# Altium schematic sheet Channel_A.SchDoc
size OrCAD E; SheetNumber: 5; SheetTotal: 6
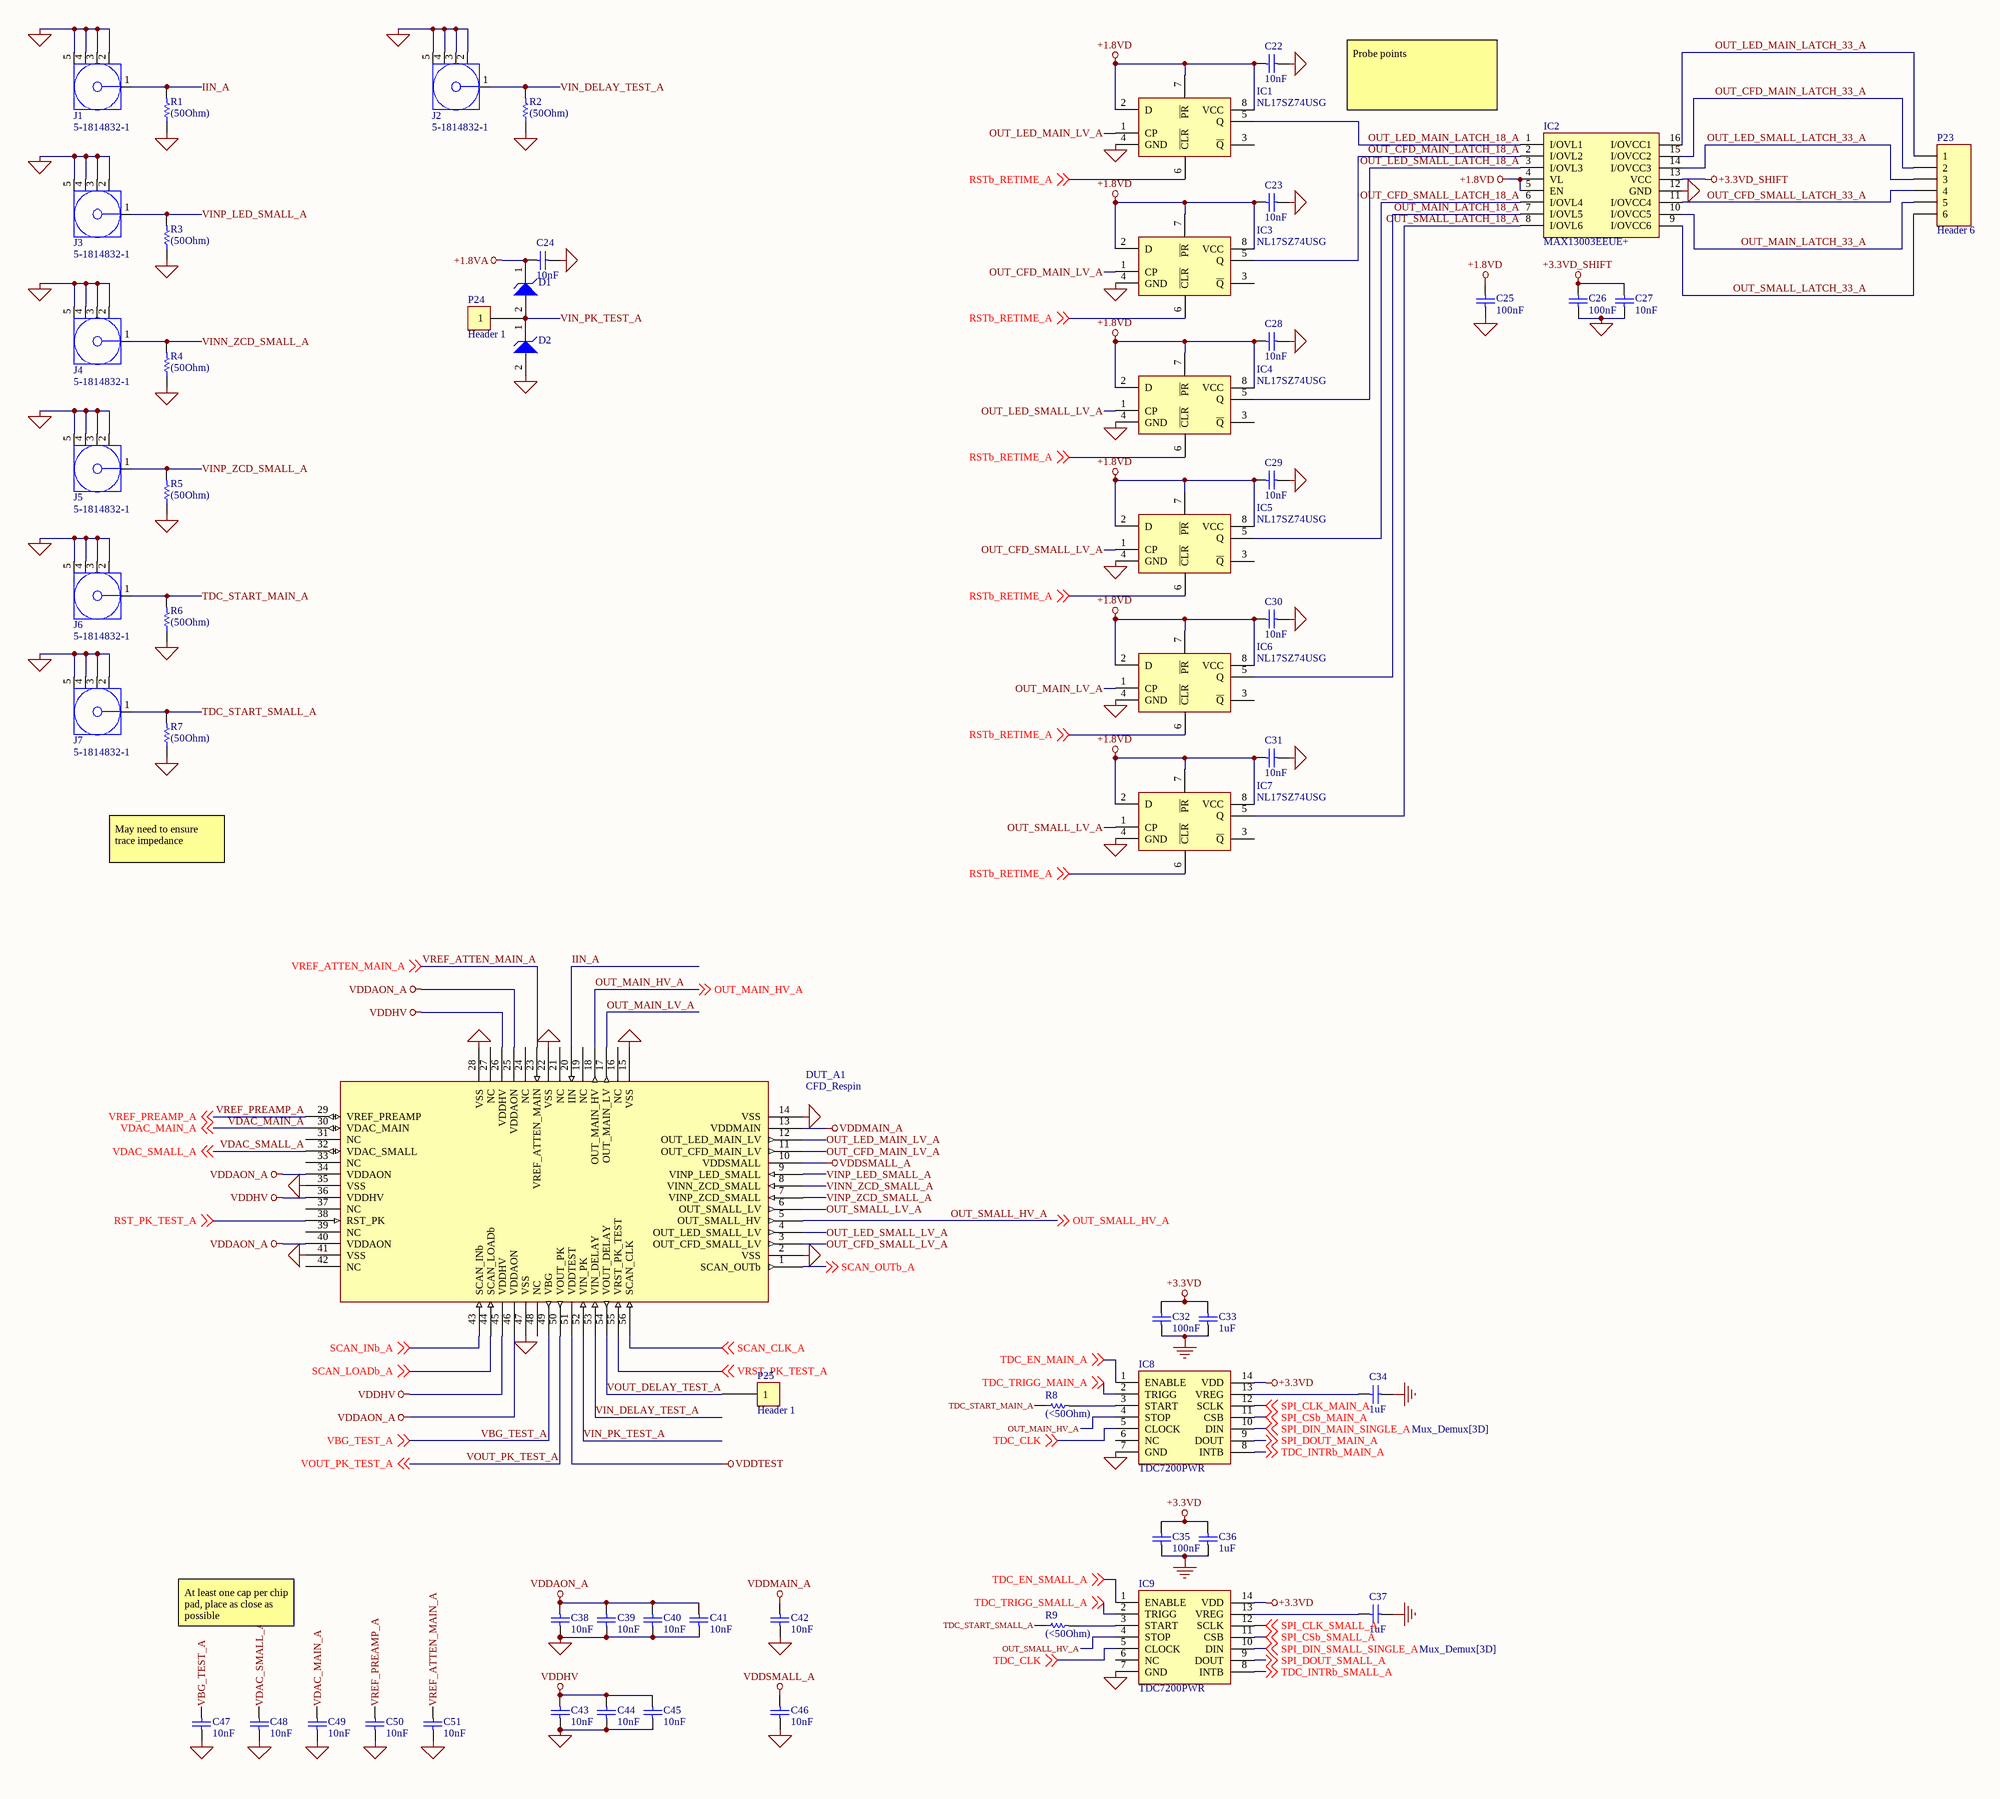
[diagram p0: Channel_A.SchDoc]

## Parts
C22  10nF  [CAPC1608X90X35ML10T15]
C23  10nF  [CAPC1608X90X35ML10T15]
C24  10nF  [CAPC1608X90X35ML10T15]
C25  100nF  [CAPC1608X90X35ML10T15]
C26  100nF  [CAPC1608X90X35ML10T15]
C27  10nF  [CAPC1608X90X35ML10T15]
C28  10nF  [CAPC1608X90X35ML10T15]
C29  10nF  [CAPC1608X90X35ML10T15]
C30  10nF  [CAPC1608X90X35ML10T15]
C31  10nF  [CAPC1608X90X35ML10T15]
C32  100nF  [CAPC1608X90X35ML10T15]
C33  1uF  [CAPC1608X90X35ML10T15]
C34  1uF  [CAPC1608X90X35ML10T15]
C35  100nF  [CAPC1608X90X35ML10T15]
C36  1uF  [CAPC1608X90X35ML10T15]
C37  1uF  [CAPC1608X90X35ML10T15]
C38  10nF  [CAPC1608X90X35ML10T15]
C39  10nF  [CAPC1608X90X35ML10T15]
C40  10nF  [CAPC1608X90X35ML10T15]
C41  10nF  [CAPC1608X90X35ML10T15]
C42  10nF  [CAPC1608X90X35ML10T15]
C43  10nF  [CAPC1608X90X35ML10T15]
C44  10nF  [CAPC1608X90X35ML10T15]
C45  10nF  [CAPC1608X90X35ML10T15]
C46  10nF  [CAPC1608X90X35ML10T15]
C47  10nF  [CAPC1608X90X35ML10T15]
C48  10nF  [CAPC1608X90X35ML10T15]
C49  10nF  [CAPC1608X90X35ML10T15]
C50  10nF  [CAPC1608X90X35ML10T15]
C51  10nF  [CAPC1608X90X35ML10T15]
D1  (no value)  [ONSC-SOD-123-2-425-04_V]
D2  (no value)  [ONSC-SOD-123-2-425-04_V]
DUT_A1  CFD_Respin  [QFN50P800X800X80_HS-57N_WIDEVIAS]
IC1  NL17SZ74USG  [SOP50P310X90-8N]
IC2  MAX13003EEUE+  [SOP65P640X110-16N]
IC3  NL17SZ74USG  [SOP50P310X90-8N]
IC4  NL17SZ74USG  [SOP50P310X90-8N]
IC5  NL17SZ74USG  [SOP50P310X90-8N]
IC6  NL17SZ74USG  [SOP50P310X90-8N]
IC7  NL17SZ74USG  [SOP50P310X90-8N]
IC8  TDC7200PWR  [SOP65P640X120-14N]
IC9  TDC7200PWR  [SOP65P640X120-14N]
J1  5-1814832-1  [TECO-5-1814832-1_V]
J2  5-1814832-1  [TECO-5-1814832-1_V]
J3  5-1814832-1  [TECO-5-1814832-1_V]
J4  5-1814832-1  [TECO-5-1814832-1_V]
J5  5-1814832-1  [TECO-5-1814832-1_V]
J6  5-1814832-1  [TECO-5-1814832-1_V]
J7  5-1814832-1  [TECO-5-1814832-1_V]
P23  Header 6  [HDR1X6]
P24  Header 1  [Header1]
P25  Header 1  [Header1]
R1  (50Ohm)  [RESC1609X50X30NL8T20]
R2  (50Ohm)  [RESC1609X50X30NL8T20]
R3  (50Ohm)  [RESC1609X50X30NL8T20]
R4  (50Ohm)  [RESC1609X50X30NL8T20]
R5  (50Ohm)  [RESC1609X50X30NL8T20]
R6  (50Ohm)  [RESC1609X50X30NL8T20]
R7  (50Ohm)  [RESC1609X50X30NL8T20]
R8  (<50Ohm)  [RESC1609X50X30NL8T20]
R9  (<50Ohm)  [RESC1609X50X30NL8T20]

## Nets
+1.8VA: C24.2 D1.1(K)
+1.8VD: C22.2 C23.2 C25.2 C28.2 C29.2 C30.2 C31.2 IC1.2(D) IC1.7(~{PR}) IC1.8(VCC) IC2.4(VL) IC2.5(EN) IC3.2(D) IC3.7(~{PR}) IC3.8(VCC) IC4.2(D) IC4.7(~{PR}) IC4.8(VCC) IC5.2(D) IC5.7(~{PR}) IC5.8(VCC) IC6.2(D) IC6.7(~{PR}) IC6.8(VCC) IC7.2(D) IC7.7(~{PR}) IC7.8(VCC)
+3.3VD: C32.1 C33.1 C35.1 C36.1 IC8.14(VDD) IC9.14(VDD)
+3.3VD_SHIFT: C26.2 C27.2 IC2.13(VCC)
GND: C22.1 C23.1 C24.1 C25.1 C26.1 C27.1 C28.1 C29.1 C30.1 C31.1 C32.2 C33.2 C34.2 C35.2 C36.2 C37.2 C38.1 C39.1 C40.1 C41.1 C42.1 C43.1 C44.1 C45.1 C46.1 C47.1 C48.1 C49.1 C50.1 C51.1 D2.2(A) DUT_A1.2(VSS) DUT_A1.14(VSS) DUT_A1.15(VSS) DUT_A1.22(VSS) DUT_A1.28(VSS) DUT_A1.35(VSS) DUT_A1.41(VSS) DUT_A1.47(VSS) IC1.4(GND) IC2.12(GND) IC3.4(GND) IC4.4(GND) IC5.4(GND) IC6.4(GND) IC7.4(GND) IC8.7(GND) IC9.7(GND) J1.2 J1.3 J1.4 J1.5 J2.2 J2.3 J2.4 J2.5 J3.2 J3.3 J3.4 J3.5 J4.2 J4.3 J4.4 J4.5 J5.2 J5.3 J5.4 J5.5 J6.2 J6.3 J6.4 J6.5 J7.2 J7.3 J7.4 J7.5 R1.1 R2.1 R3.1 R4.1 R5.1 R6.1 R7.1
VDDAON_A: C38.2 C39.2 C40.2 C41.2 DUT_A1.25(VDDAON) DUT_A1.34(VDDAON) DUT_A1.40(VDDAON) DUT_A1.46(VDDAON)
VDDHV: C43.2 C44.2 C45.2 DUT_A1.26(VDDHV) DUT_A1.36(VDDHV) DUT_A1.45(VDDHV)
VDDMAIN_A: C42.2 DUT_A1.13(VDDMAIN)
VDDSMALL_A: C46.2 DUT_A1.10(VDDSMALL)
VDDTEST: DUT_A1.51(VDDTEST)
IIN_A: DUT_A1.20(IIN) J1.1 R1.2
OUT_CFD_MAIN_LATCH_18_A: IC2.2(I/OVL2) IC3.5(Q)
OUT_CFD_MAIN_LATCH_33_A: IC2.15(I/OVCC2) P23.2
OUT_CFD_MAIN_LV_A: DUT_A1.11(OUT_CFD_MAIN_LV) IC3.1(CP)
OUT_CFD_SMALL_LATCH_18_A: IC2.6(I/OVL4) IC5.5(Q)
OUT_CFD_SMALL_LATCH_33_A: IC2.11(I/OVCC4) P23.4
OUT_CFD_SMALL_LV_A: DUT_A1.3(OUT_CFD_SMALL_LV) IC5.1(CP)
OUT_LED_MAIN_LATCH_18_A: IC1.5(Q) IC2.1(I/OVL1)
OUT_LED_MAIN_LATCH_33_A: IC2.16(I/OVCC1) P23.1
OUT_LED_MAIN_LV_A: DUT_A1.12(OUT_LED_MAIN_LV) IC1.1(CP)
OUT_LED_SMALL_LATCH_18_A: IC2.3(I/OVL3) IC4.5(Q)
OUT_LED_SMALL_LATCH_33_A: IC2.14(I/OVCC3) P23.3
OUT_LED_SMALL_LV_A: DUT_A1.4(OUT_LED_SMALL_LV) IC4.1(CP)
OUT_MAIN_HV_A: DUT_A1.18(OUT_MAIN_HV) IC8.4(STOP) ; off-sheet OUT_MAIN_HV_A
OUT_MAIN_LATCH_18_A: IC2.7(I/OVL5) IC6.5(Q)
OUT_MAIN_LATCH_33_A: IC2.10(I/OVCC5) P23.5
OUT_MAIN_LV_A: DUT_A1.17(OUT_MAIN_LV) IC6.1(CP)
OUT_SMALL_HV_A: DUT_A1.5(OUT_SMALL_HV) IC9.4(STOP) ; off-sheet OUT_SMALL_HV_A
OUT_SMALL_LATCH_18_A: IC2.8(I/OVL6) IC7.5(Q)
OUT_SMALL_LATCH_33_A: IC2.9(I/OVCC6) P23.6
OUT_SMALL_LV_A: DUT_A1.6(OUT_SMALL_LV) IC7.1(CP)
RST_PK_TEST_A: DUT_A1.38(RST_PK) ; off-sheet RST_PK_TEST_A
RSTb_RETIME_A: IC1.6(~{CLR}) IC3.6(~{CLR}) IC4.6(~{CLR}) IC5.6(~{CLR}) IC6.6(~{CLR}) IC7.6(~{CLR}) ; off-sheet RSTb_RETIME_A
SCAN_CLK_A: DUT_A1.56(SCAN_CLK) ; off-sheet SCAN_CLK_A
SCAN_INb_A: DUT_A1.43(SCAN_INb) ; off-sheet SCAN_INb_A
SCAN_LOADb_A: DUT_A1.44(SCAN_LOADb) ; off-sheet SCAN_LOADb_A
SCAN_OUTb_A: DUT_A1.1(SCAN_OUTb) ; off-sheet SCAN_OUTb_A
SPI_CLK_MAIN_A: IC8.12(SCLK) ; off-sheet SPI_CLK_MAIN_A
SPI_CLK_SMALL_A: IC9.12(SCLK) ; off-sheet SPI_CLK_SMALL_A
SPI_CSb_MAIN_A: IC8.11(CSB) ; off-sheet SPI_CSb_MAIN_A
SPI_CSb_SMALL_A: IC9.11(CSB) ; off-sheet SPI_CSb_SMALL_A
SPI_DIN_MAIN_SINGLE_A: IC8.10(DIN) ; off-sheet SPI_DIN_MAIN_SINGLE_A
SPI_DIN_SMALL_SINGLE_A: IC9.10(DIN) ; off-sheet SPI_DIN_SMALL_SINGLE_A
SPI_DOUT_MAIN_A: IC8.9(DOUT) ; off-sheet SPI_DOUT_MAIN_A
SPI_DOUT_SMALL_A: IC9.9(DOUT) ; off-sheet SPI_DOUT_SMALL_A
TDC_CLK: IC8.5(CLOCK) IC9.5(CLOCK) ; off-sheet TDC_CLK
TDC_EN_MAIN_A: IC8.1(ENABLE) ; off-sheet TDC_EN_MAIN_A
TDC_EN_SMALL_A: IC9.1(ENABLE) ; off-sheet TDC_EN_SMALL_A
TDC_INTRb_MAIN_A: IC8.8(INTB) ; off-sheet TDC_INTRb_MAIN_A
TDC_INTRb_SMALL_A: IC9.8(INTB) ; off-sheet TDC_INTRb_SMALL_A
TDC_START_MAIN_A: J6.1 R6.2 R8.1
TDC_START_SMALL_A: J7.1 R7.2 R9.1
TDC_TRIGG_MAIN_A: IC8.2(TRIGG) ; off-sheet TDC_TRIGG_MAIN_A
TDC_TRIGG_SMALL_A: IC9.2(TRIGG) ; off-sheet TDC_TRIGG_SMALL_A
VBG_TEST_A: C47.2 DUT_A1.49(VBG) ; off-sheet VBG_TEST_A
VDAC_MAIN_A: C49.2 DUT_A1.30(VDAC_MAIN) ; off-sheet VDAC_MAIN_A
VDAC_SMALL_A: C48.2 DUT_A1.32(VDAC_SMALL) ; off-sheet VDAC_SMALL_A
VIN_DELAY_TEST_A: DUT_A1.53(VIN_DELAY) J2.1 R2.2
VIN_PK_TEST_A: D1.2(A) D2.1(K) DUT_A1.52(VIN_PK) P24.1
VINN_ZCD_SMALL_A: DUT_A1.8(VINN_ZCD_SMALL) J4.1 R4.2
VINP_LED_SMALL_A: DUT_A1.9(VINP_LED_SMALL) J3.1 R3.2
VINP_ZCD_SMALL_A: DUT_A1.7(VINP_ZCD_SMALL) J5.1 R5.2
VOUT_DELAY_TEST_A: DUT_A1.54(VOUT_DELAY) P25.1
VOUT_PK_TEST_A: DUT_A1.50(VOUT_PK) ; off-sheet VOUT_PK_TEST_A
VREF_ATTEN_MAIN_A: C51.2 DUT_A1.23(VREF_ATTEN_MAIN) ; off-sheet VREF_ATTEN_MAIN_A
VREF_PREAMP_A: C50.2 DUT_A1.29(VREF_PREAMP) ; off-sheet VREF_PREAMP_A
VRST_PK_TEST_A: DUT_A1.55(VRST_PK_TEST) ; off-sheet VRST_PK_TEST_A
NetC34_1: C34.1 IC8.13(VREG)
NetC37_1: C37.1 IC9.13(VREG)
NetIC8_3: IC8.3(START) R8.2
NetIC9_3: IC9.3(START) R9.2

Not connected (* = marked no-connect by the designer): DUT_A1 16(NC) 19(NC) 21(NC) 24(NC) 27(NC) 31(NC) 33(NC) 37(NC) 39(NC) 42(NC) 48(NC); IC1 3(~{Q}); IC3 3(~{Q}); IC4 3(~{Q}); IC5 3(~{Q}); IC6 3(~{Q}); IC7 3(~{Q}); IC8 6(NC); IC9 6(NC)

## Notes on the sheet
- Probe points
- May need to ensure trace impedance
- At least one cap per chip pad, place as close as possible

## Library data of the parts
C22-C51 = CMP-2000-04945-1: 0603; Manufacturer: Murata; Capacitance: 22pF; Tolerance (%): ±5%; Rated Voltage: 50V; Dielectric: C0G; Manufacturer URL: http://www.murata.com/; Datasheet Version: Jul-06; Package Reference: 603; Case Size/Dimension: 0603; Package Description: 2-Pin Surface Mount Device, Body 1.6 x 0.8 mm; Datasheet URL: https://datasheet.ciiva.com/11786/0900766b807a1cab-11786398.pdf
D1 D2 = CMP-1060-00509-1: Zener Voltage Regulator, 2-Pin SOD-123, Pb-Free, Tape and Reel; Manufacturer: On Semiconductor; PartNumber: MMSZ4679T1G; P Max (W): 0.5; VZ Typ (V): 2; Packing: Tape and Reel; ComponentLink1Description: Manufacturer URL; DatasheetVersion: Rev. 9; PackageReference: SOD-123-2-425-04; ComponentLink3URL: http://www.onsemi.com/pub_link/Collateral/425-04.PDF; PackageDescription: 2-Pin SOD, Body 1.6 x 2.69 mm; ComponentLink3Description: Package Specification; ComponentLink2Description: Datasheet; ComponentLink1URL: http://www.onsemi.com/; RoHS: Pb-Free; PackageVersion: Rev. G, 10/2009; ComponentLink2URL: http://www.onsemi.com/pub_link/Collateral/MMSZ4678T1-D.PDF; Mounting Technology: Surface Mount
IC1 IC3-IC7 = NL17SZ74USG: Flip Flops 1.65-5.5V CMOS Single D-Type; Manufacturer_Name: ON Semiconductor; Datasheet Link: http://www.onsemi.com/pub/Collateral/NL17SZ74-D.PDF; Height: 0.9mm; Manufacturer_Part_Number: NL17SZ74USG
IC2 = MAX13003EEUE+: Integrated Circuit; Manufacturer_Name: Maxim Integrated; Datasheet Link: https://pdfserv.maximintegrated.com/en/ds/MAX13000E-MAX13005E.pdf; Height: 1.1mm; Manufacturer_Part_Number: MAX13003EEUE+
IC8 IC9 = TDC7200PWR: Integrated Circuit; Manufacturer_Name: Texas Instruments; Datasheet Link: http://www.ti.com/lit/gpn/tdc7200; Height: 1.2mm; Manufacturer_Part_Number: TDC7200PWR
J1-J7 = CMP-2000-05415-1: SMA Connector, Pitch 5.08 mm, 1 Position, Height 9.5 mm, Tail Length 4 mm, -65 to 165 degC, RoHS, Bulk; Manufacturer: TE Connectivity; Connector Mounting: PCBMount; Connector Body Style: StraightJack; Impedance: 50ohm; Coaxial Termination: Solder; SVHC: NoSVHC(15-Jun-2015); Frequency Max: 3GHz; Product Range: ZDCSeries; Connector Type: SMACoaxial; Datasheet Version: Rev. B1, 03/2011; Package Reference: 5-1814832-1; Package Description: SMA Connector, Pitch 5.08 mm, 1 Position, Height 9.5 mm, Tail Length 4 mm; Contact Plating: GoldPlatedContacts; Coaxial Cable Types: -; Contact Material: BerylliumCopper; Manufacturer URL: http://www.te.com/; Datasheet URL: http://www.onlinecomponents.com/productFiles/mf-AMP/eng_cd_1814832_a.pdf
P23 = Header 6: Header, 6-Pin; LatestRevisionDate: 17-Jul-2002; LatestRevisionNote: Re-released for DXP Platform.; Publisher: Altium Limited
R1-R9 = CMP-2000-03816-5: 0603; Manufacturer: Vishay Semiconductor; Voltage Rating: 75 V; Package Quantity: 5000; DatasheetVersion: 06/2012; Min Operating Temperature: -55 degC; ComponentLink1URL: http://www.vishay.com/; Mounting Technology: Surface Mount; Height: 0.45 mm; ComponentLink1Description: Manufacturer URL; REACH SVHC: Unknown; PackageReference: 0603; Packaging: Tape and Reel; Max Operating Temperature: 155 degC; Mount: Surface Mount; ComponentLink2Description: Datasheet; PackageDescription: 2-Pin Surface Mount Device, Body 1.575 x 0.85 mm; Length: 1.55 mm; ComponentLink2URL: http://www.vishay.com/docs/20035/dcrcwe3.pdf; Pins: 2; RoHSCompliant: true